# EAGLE design usbkey (EAGLE 6.6.0)
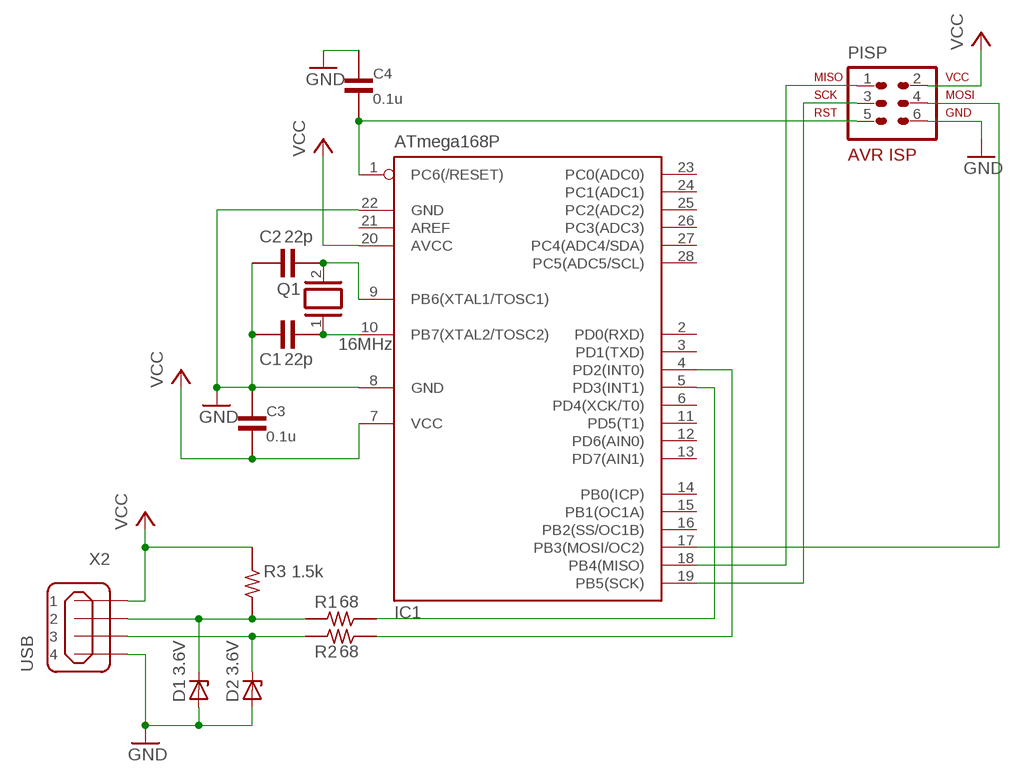
[diagram p0: schematic, sheet 1]

## Parts
C1  22p  C-50V-0302-2.54  [50-0302-2.54]
C2  22p  C-50V-0302-2.54  [50-0302-2.54]
C3  0.1u  C-50V-0302-2.54  [50-0302-2.54]
C4  0.1u  C-50V-0302-2.54  [50-0302-2.54]
D1  3.6V  BZX55  [DO35Z10]
D2  3.6V  BZX55  [DO35Z10]
IC1  ATmega168P  MEGA8-P  [DIL28-3]
PISP  AVR-ISP-6VERT  [AVR-ISP-6]
Q1  16MHz  XTAL/S  [QS]
R1  68  R-1/4W-07.62  [1/4W-7.62H]
R2  68  R-1/4W-07.62  [1/4W-7.62H]
R3  1.5k  R-1/4W-02.54-V  [1/4W-2.54V]
X2  USB  MINI-USB_SHIELD4P-85-32004-10X  [85-32004-10X]

## Nets
GND: C1.PAD2 C2.PAD2 C3.PAD1 C4.PAD1 D1.A D2.A IC1.8(GND) IC1.22(GND) PISP.6 X2.4
N$1: C1.PAD1 IC1.10(PB7(XTAL2/TOSC2)) Q1.1
N$2: C2.PAD1 IC1.9(PB6(XTAL1/TOSC1)) Q1.2
N$3: IC1.5(PD3(INT1)) R1.PAD2
N$4: D2.C R2.PAD1 X2.3
N$5: IC1.4(PD2(INT0)) R2.PAD2
N$6: D1.C R1.PAD1 R3.PAD1 X2.2
N$9: C4.PAD2 IC1.1(PC6(/RESET)) PISP.5
N$10: IC1.17(PB3(MOSI/OC2)) PISP.4
N$11: IC1.19(PB5(SCK)) PISP.3
N$12: IC1.18(PB4(MISO)) PISP.1
VCC: C3.PAD2 IC1.7(VCC) IC1.20(AVCC) PISP.2 R3.PAD2 X2.1
Unconnected: IC1.2(PD0(RXD)) IC1.3(PD1(TXD)) IC1.6(PD4(XCK/T0)) IC1.11(PD5(T1)) IC1.12(PD6(AIN0)) IC1.13(PD7(AIN1)) IC1.14(PB0(ICP)) IC1.15(PB1(OC1A)) IC1.16(PB2(SS/OC1B)) IC1.21(AREF) IC1.23(PC0(ADC0)) IC1.24(PC1(ADC1)) IC1.25(PC2(ADC2)) IC1.26(PC3(ADC3)) IC1.27(PC4(ADC4/SDA)) IC1.28(PC5(ADC5/SCL)) X2.M1(S1) X2.M2(S2)

## Library data of the parts
C1-C4 = c-j:C-: CAPACITOR Japanese symbol
D1 D2 = diode:BZX55: Z DIODE
IC1 = atmel:MEGA8-P: MICROCONTROLLER 8 Kbytes FLASH, 1 kbytes SRAM, 512 bytes EEPROM, USART, 4-channel 10 bit ADC, 2-channel 8 bit ADC Pin compatible with Atmega48, ATMega88, ATMega168 Source: avr.lbr; OC_FARNELL: unknown; OC_NEWARK: unknown
PISP = avr-7:AVR-ISP-6: AVR ISP-6 Serial Programming Header
Q1 = special:XTAL/S: CRYSTAL
R1-R3 = r-j:R-: RESISTOR Japanese symbol
X2 = con-cypressindustries:MINI-USB_SHIELD4P-: MINI USB 4 Pol. Source: www.cypressindustries.com; OC_FARNELL: unknown; OC_NEWARK: unknown

## Net classes
0 default: width 0.813 mm

## Board
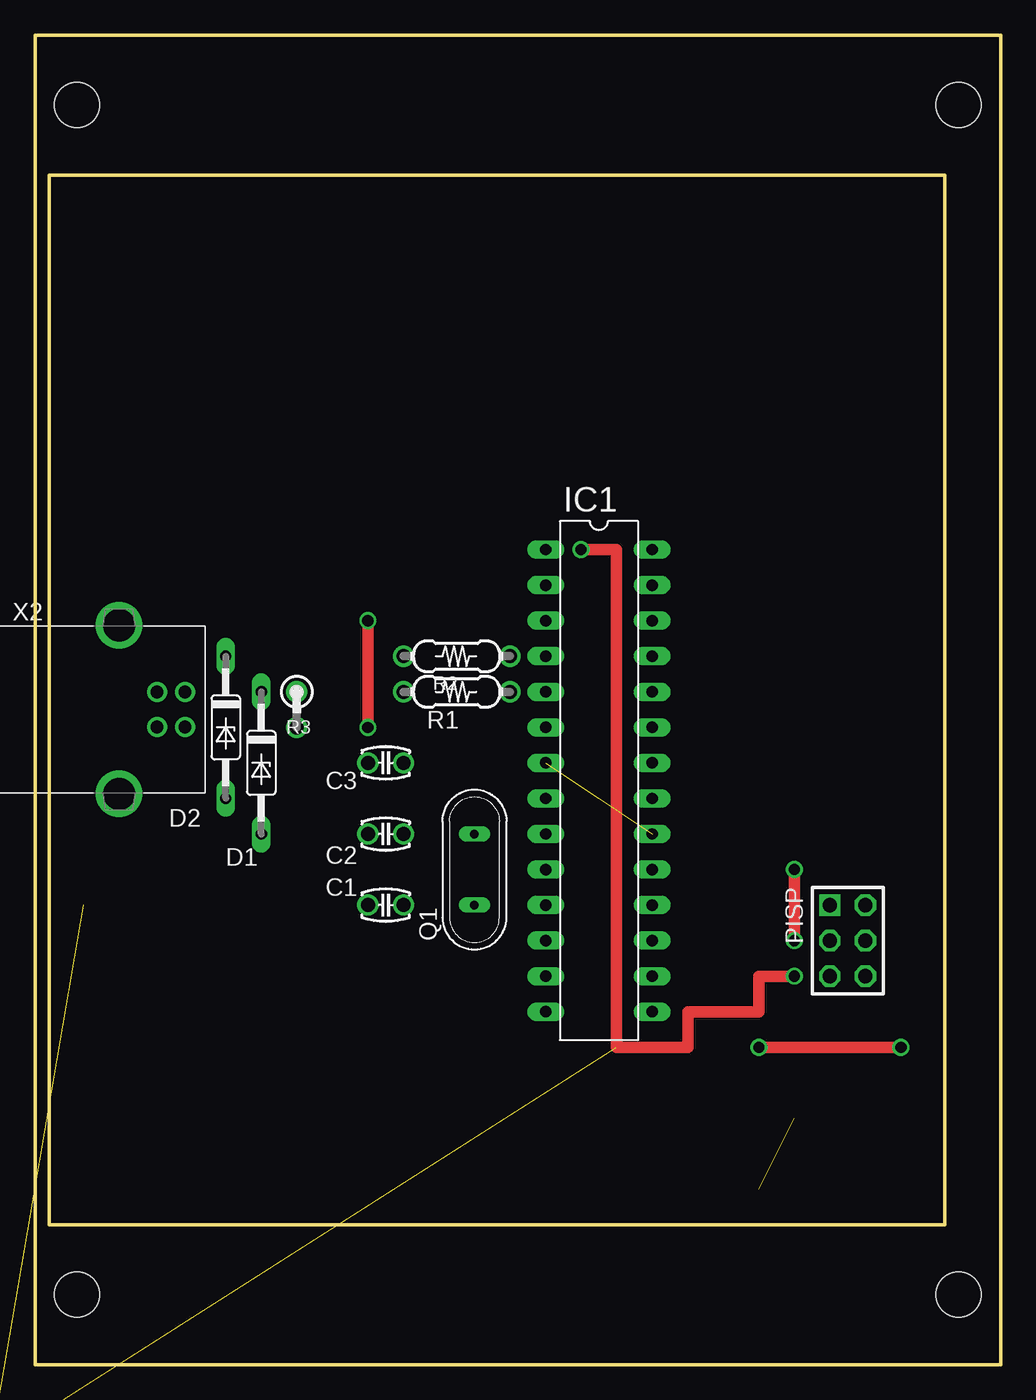
[diagram p1: board, top side]
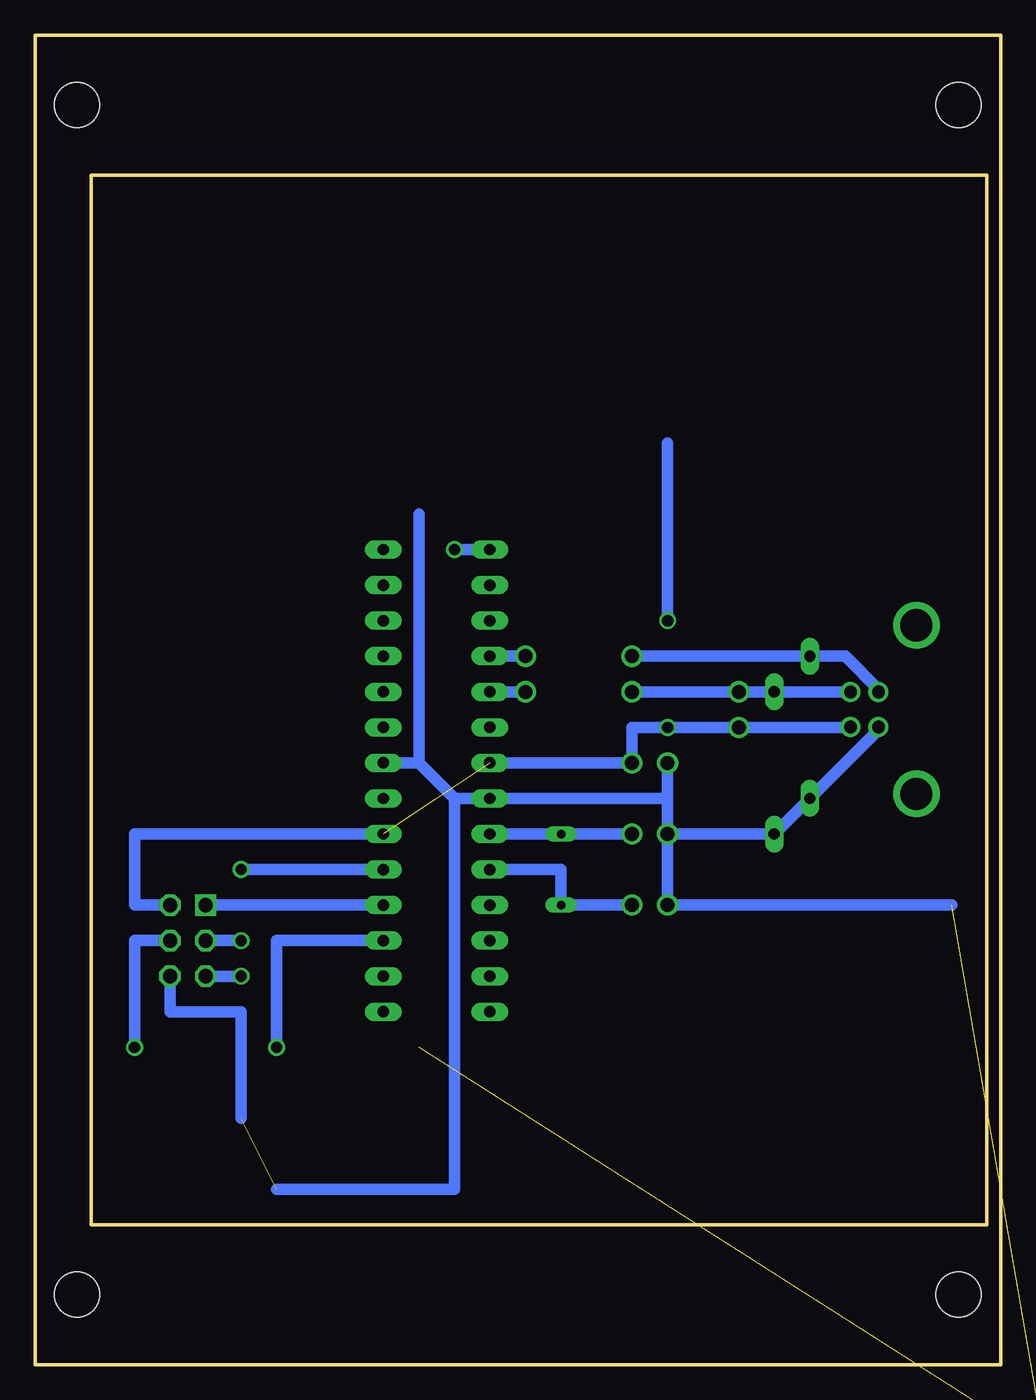
[diagram p2: board, bottom side, seen from below]

Size 69 x 95 mm. Coordinates in mm from the lower left corner, seen from the top.
Outline: 69,0 69,95 0,95 0,0 69,0
Outline: 65,10 65,85 1,85 1,10 65,10
Copper layers (1*16): Top 0.035mm / dielectric 1.5mm / Bottom 0.035mm
Design rules "default *": minimum track width 10mil, minimum drill 24mil, track to track 8mil, track to pad 8mil, pad to pad 8mil, via to via 8mil, smd to smd 8mil, copper to edge 40mil, drill to drill 8mil, minimum pad ring 10mil, minimum via ring 8mil, stop-mask expansion 4mil, vias tented up to drill 0mil, thermal gap 10mil
Holes 3.2 mm at 66,5 66,90 3,5 3,90

### Footprints (pad centres in the part's own frame; a part is rotated, then mirrored left to right if it is on the bottom)
50-0302-2.54 = drill 1: PAD1 -1.27,0; PAD2 1.27,0
DO35Z10 = drill 0.813 long: A 5.08,0; C -5.08,0
DIL28-3 = drill 0.813 long: 1 -16.51,-3.81; 2 -13.97,-3.81; 3 -11.43,-3.81; 4 -8.89,-3.81; 5 -6.35,-3.81; 6 -3.81,-3.81; 7 -1.27,-3.81; 8 1.27,-3.81; 9 3.81,-3.81; 10 6.35,-3.81; 11 8.89,-3.81; 12 11.43,-3.81; 13 13.97,-3.81; 14 16.51,-3.81; 15 16.51,3.81; 16 13.97,3.81; 17 11.43,3.81; 18 8.89,3.81; 19 6.35,3.81; 20 3.81,3.81; 21 1.27,3.81; 22 -1.27,3.81; 23 -3.81,3.81; 24 -6.35,3.81; 25 -8.89,3.81; 26 -11.43,3.81; 27 -13.97,3.81; 28 -16.51,3.81
AVR-ISP-6 = drill 1.016 square: 1 -2.54,-1.27 | drill 1.016 octagon: 2 -2.54,1.27; 3 0,-1.27; 4 0,1.27; 5 2.54,-1.27; 6 2.54,1.27
QS = drill 0.61 long: 1 -2.54,0; 2 2.54,0
1/4W-7.62H = drill 1: PAD1 -3.81,0; PAD2 3.81,0
1/4W-2.54V = drill 1: PAD1 0,0; PAD2 2.54,0
85-32004-10X = drill 0.92 pad 1.27: 1 4.71,-1.25; 2 4.71,1.25; 3 2.71,1.25; 4 2.71,-1.25 | drill 2.3 pad 3: M1 0,6.02; M2 0,-6.02

### Placement (x,y rotation side)
C1  25.06,32.83 180 top
C2  25.06,37.91 180 top
C3  25.06,42.99 0 top
C4  -1.61,-4 0 top  (outside the outline)
D1  16.17,42.99 270 top
D2  13.63,45.53 270 top
IC1  40.3,41.72 270 top
PISP  58.08,30.29 270 top
Q1  31.41,35.37 90 top
R1  30.14,48.07 0 top
R2  30.14,50.61 0 top
R3  18.71,48.07 270 top
X2  6.01,46.8 0 top

### Tracks (layer width: path | path; a pad name or v marks a point on that pad's centre or on a via)
GND  (2 unrouted)
  Bottom 0.813: C2.PAD2 C1.PAD2 3.47,32.83 | 23.79,40.45 IC1.8 39.03,40.45 | 23.79,40.45 C2.PAD2 | C3.PAD1 23.79,40.45 | 39.03,40.45 39.03,12.51 51.73,12.51 | IC1.22 41.57,42.99 | 41.57,42.99 39.03,40.45 | X2.4 8.55,45.53 D2.A D1.A C2.PAD2 | 41.57,42.99 41.57,60.77 | PISP.6 59.35,25.21 54.27,25.21 54.27,17.59
N$1
  Bottom 0.813: IC1.10 31.41,35.37 Q1.1 C1.PAD1
N$2
  Bottom 0.813: IC1.9 Q1.2 C2.PAD1
N$3
  Bottom 0.813: R1.PAD2 IC1.5
N$4
  Bottom 0.813: X2.3 8.55,48.07 11.09,50.61 D2.C R2.PAD1
N$5
  Bottom 0.813: R2.PAD2 IC1.4
N$6
  Bottom 0.813: R1.PAD1 R3.PAD1 D1.C 10.72,48.07 X2.2 11.09,48.07
N$9  (via drill 0.8)  (1 unrouted)
  Top 0.813: v39.03,58.23 41.57,58.23 41.57,22.67 46.65,22.67 46.65,25.21 51.73,25.21 51.73,27.75 v54.27,27.75
  Bottom 0.813: IC1.1 v39.03,58.23 | v54.27,27.75 PISP.5
N$10  (via drill 0.8)
  Top 0.813: v51.73,22.67 v61.89,22.67
  Bottom 0.813: IC1.17 51.73,30.29 v51.73,22.67 | v61.89,22.67 61.89,30.29 PISP.4
N$11  (via drill 0.8)
  Top 0.813: v54.27,35.37 v54.27,30.29
  Bottom 0.813: IC1.19 v54.27,35.37 | v54.27,30.29 PISP.3
N$12
  Bottom 0.813: IC1.18 PISP.1
VCC  (via drill 0.8)  (1 unrouted)
  Top 0.813: v23.79,53.15 v23.79,45.53
  Bottom 0.813: IC1.7 C3.PAD2 26.33,45.53 v23.79,45.53 R3.PAD2 11.09,45.53 X2.1 | IC1.20 61.89,37.91 61.89,32.83 PISP.2 | 23.79,65.85 v23.79,53.15